# Altium schematic sheet MEM.SchDoc
size A4
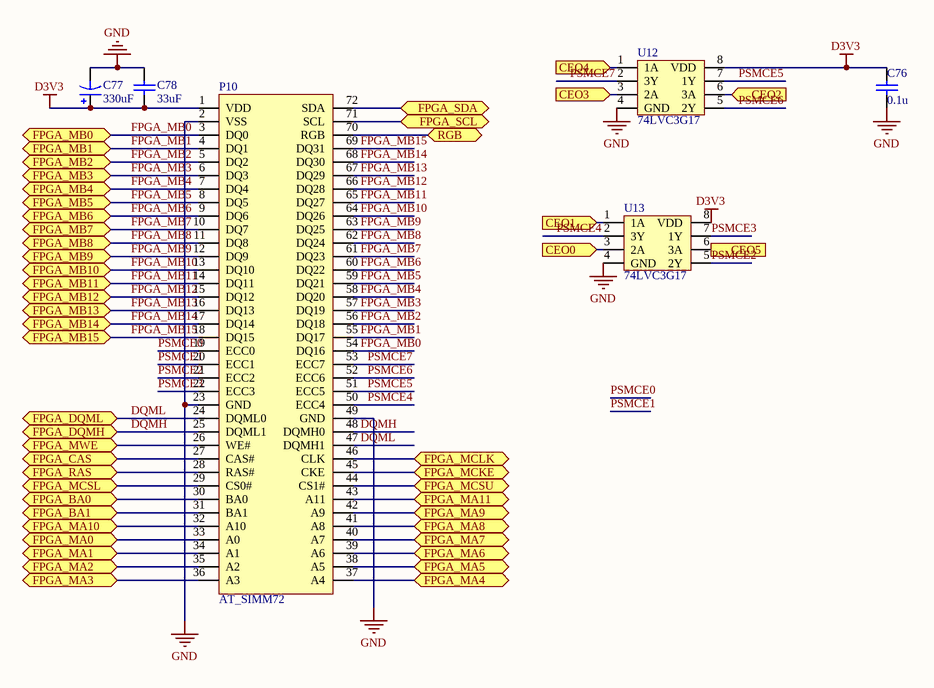
[diagram p0: MEM.SchDoc]

## Parts
C76  value 0.1u  [0603C]  (hidden comment: Cap)
C77  value 330uF  [TanCap-1210]  (hidden comment: 330u)
C78  value 33uF  [0603C]  (hidden comment: 106)
P10  AT_SIMM72  [ATSIMM72]
U12  74LVC3G17  [TSSOP-8N_3x3]
U13  74LVC3G17  [TSSOP-8N_3x3]

## Ports
CEO0 (in), CEO1 (in), CEO2 (in), CEO3 (in), CEO4 (in), CEO5 (in), FPGA_BA0 (bidir), FPGA_BA1 (bidir), FPGA_CAS (bidir), FPGA_DQMH (bidir), FPGA_DQML (bidir), FPGA_MA0 (bidir), FPGA_MA1 (bidir), FPGA_MA2 (bidir), FPGA_MA3 (bidir), FPGA_MA4 (bidir), FPGA_MA5 (bidir), FPGA_MA6 (bidir), FPGA_MA7 (bidir), FPGA_MA8 (bidir), FPGA_MA9 (bidir), FPGA_MA10 (bidir), FPGA_MA11 (bidir), FPGA_MB0 (bidir), FPGA_MB1 (bidir), FPGA_MB2 (bidir), FPGA_MB3 (bidir), FPGA_MB4 (bidir), FPGA_MB5 (bidir), FPGA_MB6 (bidir), FPGA_MB7 (bidir), FPGA_MB8 (bidir), FPGA_MB9 (bidir), FPGA_MB10 (bidir), FPGA_MB11 (bidir), FPGA_MB12 (bidir), FPGA_MB13 (bidir), FPGA_MB14 (bidir), FPGA_MB15 (bidir), FPGA_MCKE (bidir), FPGA_MCLK (bidir), FPGA_MCSL (bidir), FPGA_MCSU (bidir), FPGA_MWE (bidir), FPGA_RAS (bidir), FPGA_SCL (bidir), FPGA_SDA (bidir), RGB (bidir)

## Nets
D3V3: C76.2 C77.1 C78.2 P10.1(VDD) U12.8(VDD) U13.8(VDD)
GND: C76.1 C77.2 C78.1 P10.2(VSS) P10.23(GND) P10.49(GND) U12.4(GND) U13.4(GND)
CEO0: U13.3(2A) ; port CEO0
CEO1: U13.1(1A) ; port CEO1
CEO2: U12.6(3A) ; port CEO2
CEO3: U12.3(2A) ; port CEO3
CEO4: U12.1(1A) ; port CEO4
CEO5: U13.6(3A) ; port CEO5
DQMH: P10.25(DQML1) P10.48(DQMH0) ; port FPGA_DQMH
DQML: P10.24(DQML0) P10.47(DQMH1) ; port FPGA_DQML
FPGA_BA0: P10.30(BA0) ; port FPGA_BA0
FPGA_BA1: P10.31(BA1) ; port FPGA_BA1
FPGA_CAS: P10.27(CAS#) ; port FPGA_CAS
FPGA_MA0: P10.33(A0) ; port FPGA_MA0
FPGA_MA1: P10.34(A1) ; port FPGA_MA1
FPGA_MA2: P10.35(A2) ; port FPGA_MA2
FPGA_MA3: P10.36(A3) ; port FPGA_MA3
FPGA_MA4: P10.37(A4) ; port FPGA_MA4
FPGA_MA5: P10.38(A5) ; port FPGA_MA5
FPGA_MA6: P10.39(A6) ; port FPGA_MA6
FPGA_MA7: P10.40(A7) ; port FPGA_MA7
FPGA_MA8: P10.41(A8) ; port FPGA_MA8
FPGA_MA9: P10.42(A9) ; port FPGA_MA9
FPGA_MA10: P10.32(A10) ; port FPGA_MA10
FPGA_MA11: P10.43(A11) ; port FPGA_MA11
FPGA_MB0: P10.3(DQ0) P10.54(DQ16) ; port FPGA_MB0
FPGA_MB1: P10.4(DQ1) P10.55(DQ17) ; port FPGA_MB1
FPGA_MB2: P10.5(DQ2) P10.56(DQ18) ; port FPGA_MB2
FPGA_MB3: P10.6(DQ3) P10.57(DQ19) ; port FPGA_MB3
FPGA_MB4: P10.7(DQ4) P10.58(DQ20) ; port FPGA_MB4
FPGA_MB5: P10.8(DQ5) P10.59(DQ21) ; port FPGA_MB5
FPGA_MB6: P10.9(DQ6) P10.60(DQ22) ; port FPGA_MB6
FPGA_MB7: P10.10(DQ7) P10.61(DQ23) ; port FPGA_MB7
FPGA_MB8: P10.11(DQ8) P10.62(DQ24) ; port FPGA_MB8
FPGA_MB9: P10.12(DQ9) P10.63(DQ25) ; port FPGA_MB9
FPGA_MB10: P10.13(DQ10) P10.64(DQ26) ; port FPGA_MB10
FPGA_MB11: P10.14(DQ11) P10.65(DQ27) ; port FPGA_MB11
FPGA_MB12: P10.15(DQ12) P10.66(DQ28) ; port FPGA_MB12
FPGA_MB13: P10.16(DQ13) P10.67(DQ29) ; port FPGA_MB13
FPGA_MB14: P10.17(DQ14) P10.68(DQ30) ; port FPGA_MB14
FPGA_MB15: P10.18(DQ15) P10.69(DQ31) ; port FPGA_MB15
FPGA_MCKE: P10.45(CKE) ; port FPGA_MCKE
FPGA_MCLK: P10.46(CLK) ; port FPGA_MCLK
FPGA_MCSL: P10.29(CS0#) ; port FPGA_MCSL
FPGA_MCSU: P10.44(CS1#) ; port FPGA_MCSU
FPGA_MWE: P10.26(WE#) ; port FPGA_MWE
FPGA_RAS: P10.28(RAS#) ; port FPGA_RAS
FPGA_SCL: P10.71(SCL) ; port FPGA_SCL
FPGA_SDA: P10.72(SDA) ; port FPGA_SDA
PSMCE0: P10.19(ECC0)
PSMCE1: P10.20(ECC1)
PSMCE2: P10.21(ECC2) U13.5(2Y)
PSMCE3: P10.22(ECC3) U13.7(1Y)
PSMCE4: P10.50(ECC4) U13.2(3Y)
PSMCE5: P10.51(ECC5) U12.7(1Y)
PSMCE6: P10.52(ECC6) U12.5(2Y)
PSMCE7: P10.53(ECC7) U12.2(3Y)
RGB: P10.70(RGB) ; port RGB

## Library data of the parts
C76 = Cap: Capacitor; Published: 8-Jun-2000; LatestRevisionDate: 17-Jul-2002; LatestRevisionNote: Re-released for DXP Platform.; PackageReference: RAD-0.3; Publisher: Altium Limited; PackageDescription: Radial Cap, Thru-Hole; 2 Leads; 0.3 in Pin Spacing
C77 = Cap Pol1: Polarized Capacitor (Radial); Published: 8-Jun-2000; LatestRevisionDate: 17-Jul-2002; LatestRevisionNote: Re-released for DXP Platform.; PackageReference: RB7.6-15; Publisher: Altium Limited; PackageDescription: Polarized Capacitor (Radial); 2 Leads
C78 = Cap: Ceramic Capacitor 0603; Published: 8-Jun-2000; LatestRevisionDate: 17-Jul-2002; LatestRevisionNote: Re-released for DXP Platform.; PackageReference: RAD-0.3; Publisher: Altium Limited; PackageDescription: Radial Cap, Thru-Hole; 2 Leads; 0.3 in Pin Spacing